# Altium schematic sheet Page 2.SchDoc
size 594 x 420 mm; Address1: Address1; Address2: Address2; Address3: Address3; Address4: Address4; DocumentNumber: НЭС.185014.2017-5.1; SheetNumber: 2; SheetTotal: 3; Scale: 1:1; DocumentType: Схема электрическая принципиальная; FirstReferrence: НЭС.185014.2017-5.1
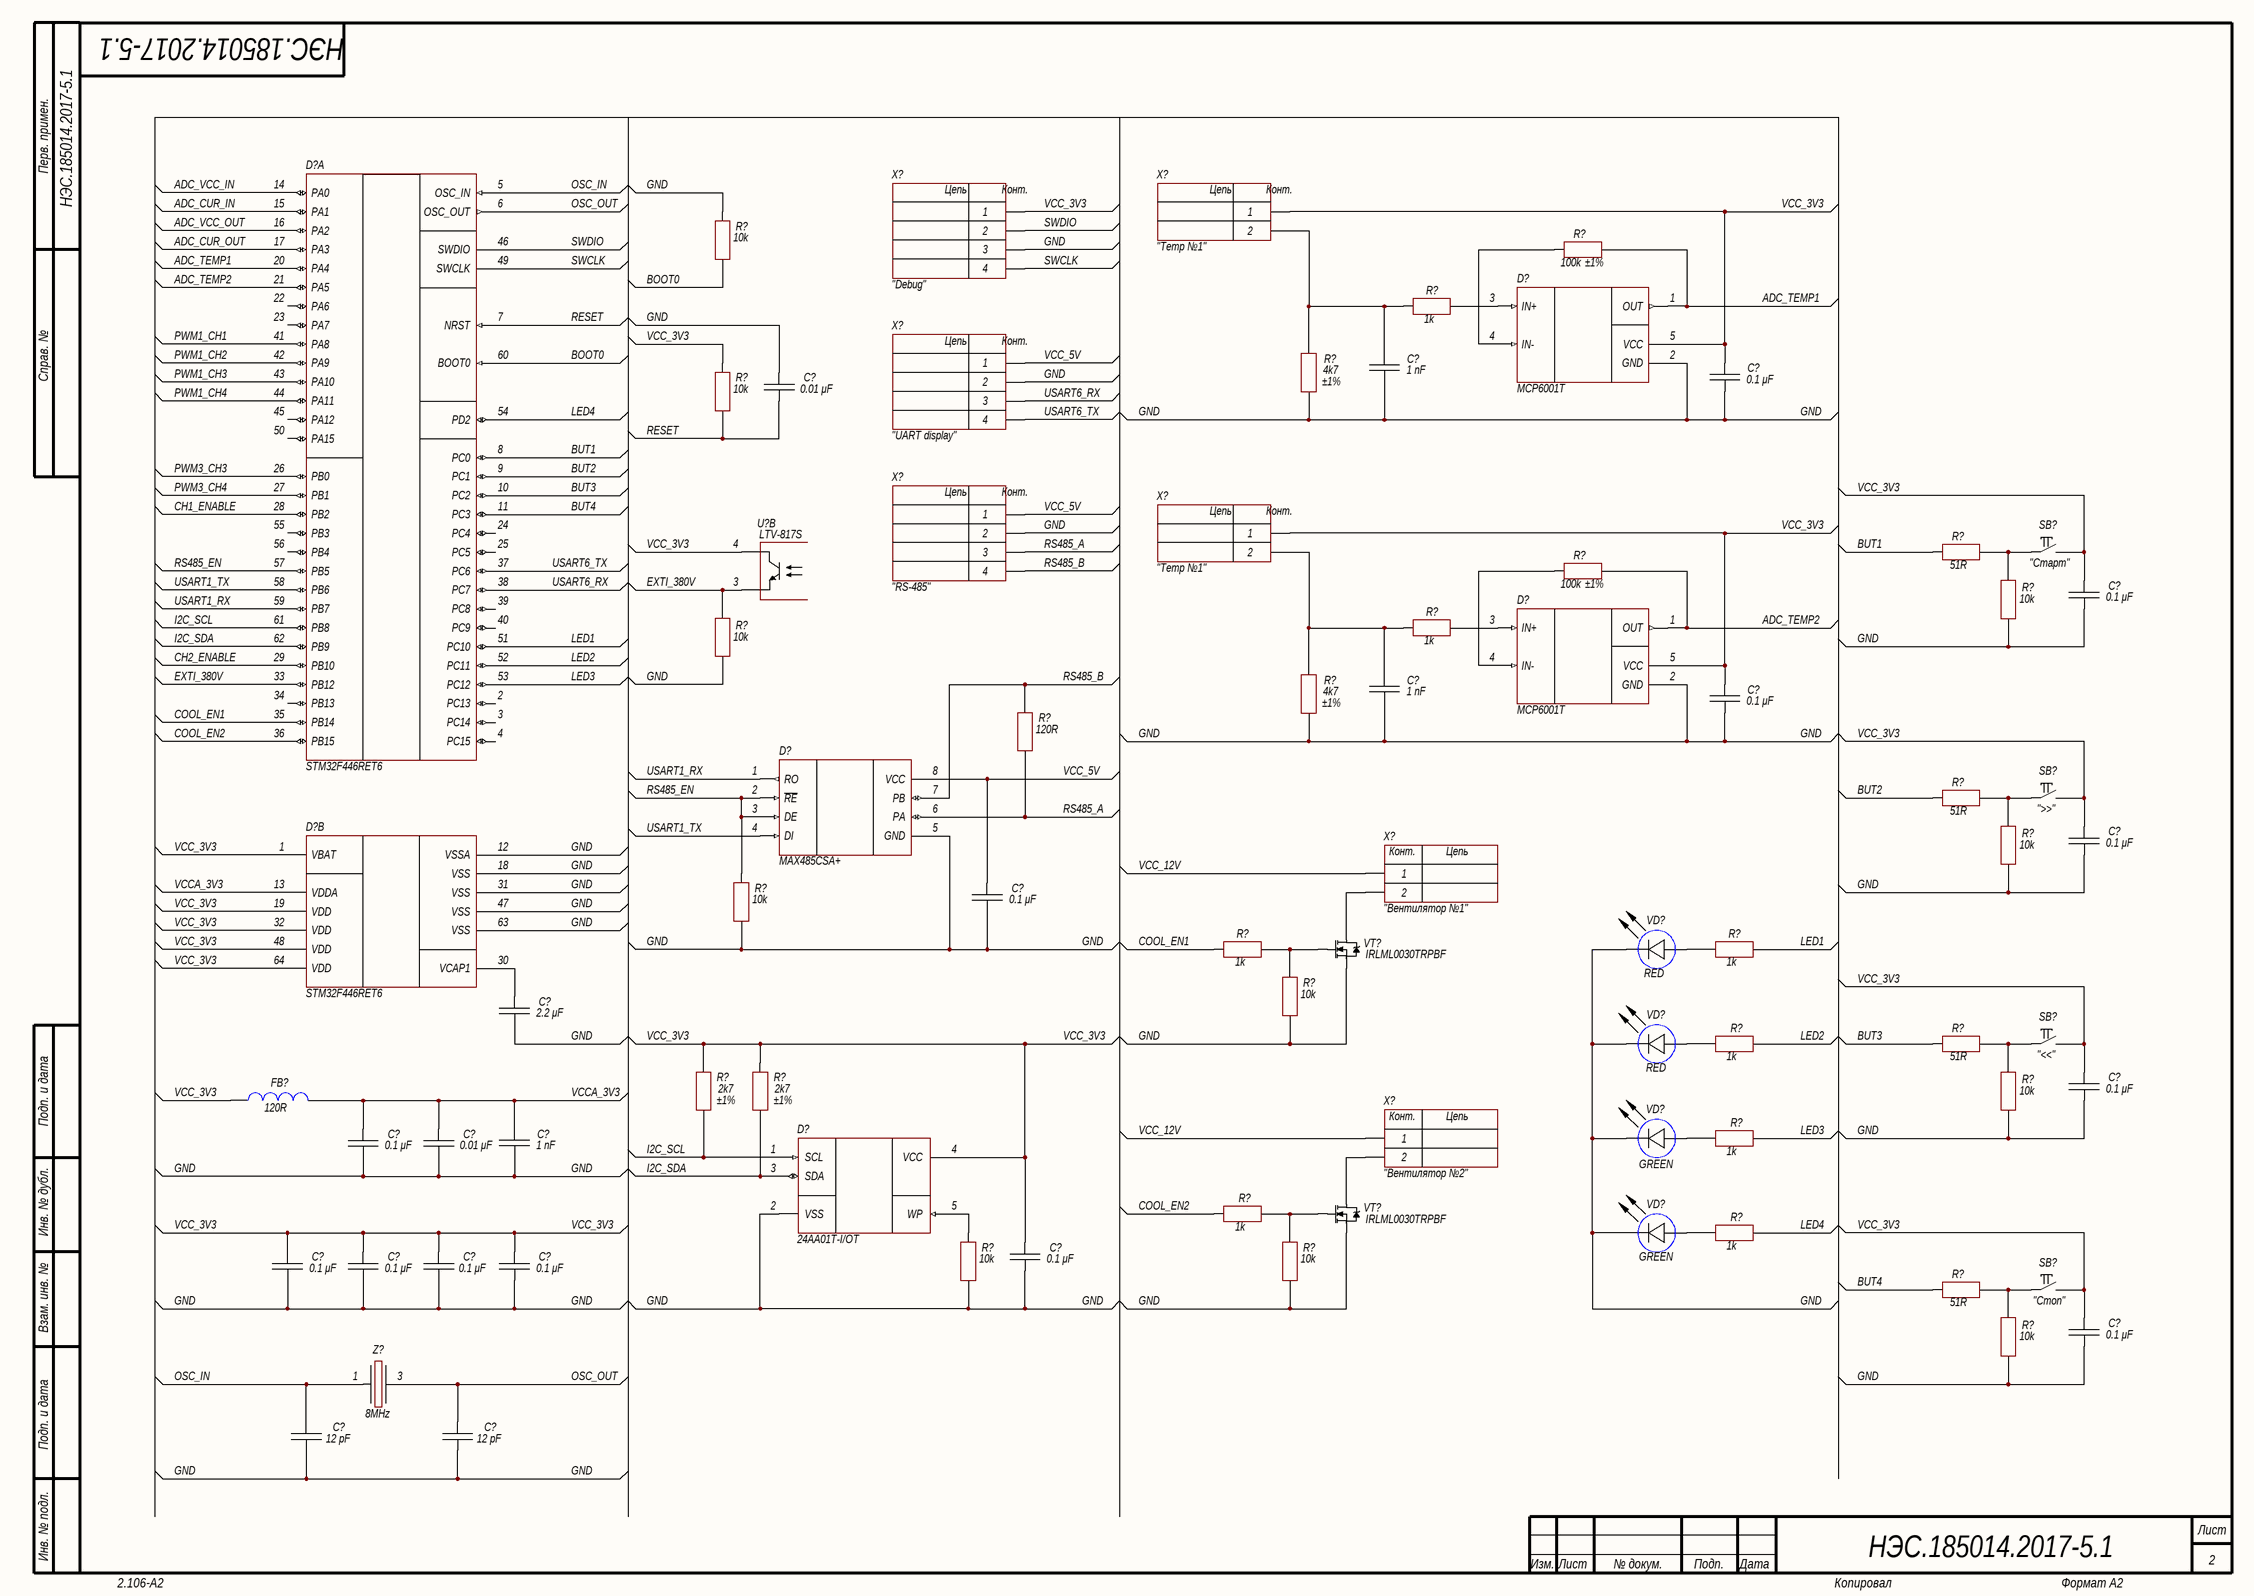
[diagram p0: Page 2.SchDoc]

## Parts
(Parts that share a designator on the sheet are numbered #1, #2 ... from top to bottom, then left to right.)
C?#1  1 nF  [CH0805C]
C?#2  0.1 μF  [CH0805C]
C?#3  0.01 μF  [CH0805C]
C?#4  0.1 μF  [CH0805C]
C?#5  1 nF  [CH0805C]
C?#6  0.1 μF  [CH0805C]
C?#7  0.1 μF  [CH0805C]
C?#8  0.1 μF  [CH0805C]
C?#9  2.2 μF  [CH0805C]
C?#10  0.1 μF  [CH0805C]
C?#11  0.1 μF  [CH0805C]
C?#12  0.01 μF  [CH0805C]
C?#13  1 nF  [CH0805C]
C?#14  0.1 μF  [CH0805C]
C?#15  0.1 μF  [CH0805C]
C?#16  0.1 μF  [CH0805C]
C?#17  0.1 μF  [CH0805C]
C?#18  0.1 μF  [CH0805C]
C?#19  0.1 μF  [CH0805C]
C?#20  12 pF  [CH0805C]
C?#21  12 pF  [CH0805C]
D?#1  STM32F446RET6  [64-LQFP]  (part A of 2)
D?#2  MCP6001T  [SOT23-5]
D?#3  MCP6001T  [SOT23-5]
D?#4  MAX485CSA+  [8-SOIC]
D?#5  STM32F446RET6  [64-LQFP]  (part B of 2)
D?#6  24AA01T-I/OT  [SOT23-5]
FB?  120R  [CH0805L]
R?#1  100k  ComponentKind: ±1%  [CH0805R]
R?#2  10k  [CH0805R]
R?#3  1k  [CH0805R]
R?#4  4k7  ComponentKind: ±1%  [CH0805R]
R?#5  10k  [CH0805R]
R?#6  51R  [CH0805R]
R?#7  100k  ComponentKind: ±1%  [CH0805R]
R?#8  1k  [CH0805R]
R?#9  10k  [CH0805R]
R?#10  10k  [CH0805R]
R?#11  4k7  ComponentKind: ±1%  [CH0805R]
R?#12  120R  [CH0805R]
R?#13  51R  [CH0805R]
R?#14  10k  [CH0805R]
R?#15  10k  [CH0805R]
R?#16  1k  [CH0805R]
R?#17  1k  [CH0805R]
R?#18  10k  [CH0805R]
R?#19  1k  [CH0805R]
R?#20  51R  [CH0805R]
R?#21  2k7  ComponentKind: ±1%  [CH0805R]
R?#22  2k7  ComponentKind: ±1%  [CH0805R]
R?#23  10k  [CH0805R]
R?#24  1k  [CH0805R]
R?#25  1k  [CH0805R]
R?#26  1k  [CH0805R]
R?#27  10k  [CH0805R]
R?#28  10k  [CH0805R]
R?#29  51R  [CH0805R]
R?#30  10k  [CH0805R]
SB?#1  "Старт"  [BUT: 6x6 SMD]
SB?#2  ">>"  [BUT: 6x6 SMD]
SB?#3  "<<"  [BUT: 6x6 SMD]
SB?#4  "Стоп"  [BUT: 6x6 SMD]
U?  LTV-817S  [4-SMD]  (part B of 2)
VD?#1  RED  [CH0805LR]
VD?#2  RED  [CH0805LR]
VD?#3  GREEN  [CH0805LG]
VD?#4  GREEN  [CH0805LG]
VT?#1  IRLML0030TRPBF  [SOT23_123]
VT?#2  IRLML0030TRPBF  [SOT23_123]
X?#1  "Debug"  [CON: PLD-4]
X?#2  "Temp №1"  [CON: WF-02]
X?#3  "UART display"  [CON: WF-04]
X?#4  "RS-485"  [CON: WF-04]
X?#5  "Temp №1"  [CON: WF-02]
X?#6  "Вентилятор №1"  [CON: WF-02]
X?#7  "Вентилятор №2"  [CON: WF-02]
Z?  8MHz  [OSC: 5032]

## Nets
ADC_CUR_IN: D?#1.15(PA1)
ADC_CUR_OUT: D?#1.17(PA3)
ADC_TEMP1: D?#1.20(PA4) D?#2.1(OUT) R?#1.2
ADC_TEMP2: D?#1.21(PA5) D?#3.1(OUT) R?#7.2
ADC_VCC_IN: D?#1.14(PA0)
ADC_VCC_OUT: D?#1.16(PA2)
BOOT0: D?#1.60(BOOT0) R?#2.1
BUT1: D?#1.8(PC0) R?#6.2
BUT2: D?#1.9(PC1) R?#13.2
BUT3: D?#1.10(PC2) R?#20.2
BUT4: D?#1.11(PC3) R?#29.2
CH1_ENABLE: D?#1.28(PB2)
CH2_ENABLE: D?#1.29(PB10)
COOL_EN1: D?#1.35(PB14) R?#16.2
COOL_EN2: D?#1.36(PB15) R?#25.2
EXTI_380V: D?#1.33(PB12) R?#10.2 U?.3(E)
GND: C?#1.1 C?#2.1 C?#3.2 C?#4.1 C?#5.1 C?#6.1 C?#7.1 C?#8.1 C?#9.1 C?#10.1 C?#11.1 C?#12.1 C?#13.1 C?#14.1 C?#15.1 C?#16.1 C?#17.1 C?#18.1 C?#19.1 C?#20.1 C?#21.1 D?#2.2(GND) D?#3.2(GND) D?#4.5(GND) D?#5.12(VSSA) D?#5.18(VSS) D?#5.31(VSS) D?#5.47(VSS) D?#5.63(VSS) D?#6.2(VSS) R?#2.2 R?#4.1 R?#9.1 R?#10.1 R?#11.1 R?#14.1 R?#15.1 R?#18.1 R?#23.1 R?#27.1 R?#28.1 R?#30.1 VD?#1.2(C) VD?#2.2(C) VD?#3.2(C) VD?#4.2(C) VT?#1.3(S) VT?#2.3(S) X?#1.3 X?#3.2 X?#4.2
I2C_SCL: D?#1.61(PB8) D?#6.1(SCL) R?#21.2
I2C_SDA: D?#1.62(PB9) D?#6.3(SDA) R?#22.2
LED1: D?#1.51(PC10) R?#17.1
LED2: D?#1.52(PC11) R?#19.1
LED3: D?#1.53(PC12) R?#24.1
LED4: D?#1.54(PD2) R?#26.1
OSC_IN: C?#20.2 D?#1.5(OSC_IN) Z?.1
OSC_OUT: C?#21.2 D?#1.6(OSC_OUT) Z?.3
PWM1_CH1: D?#1.41(PA8)
PWM1_CH2: D?#1.42(PA9)
PWM1_CH3: D?#1.43(PA10)
PWM1_CH4: D?#1.44(PA11)
PWM3_CH3: D?#1.26(PB0)
PWM3_CH4: D?#1.27(PB1)
RESET: C?#3.1 D?#1.7(NRST) R?#5.1
RS485_A: D?#4.6(PA) R?#12.1 X?#4.3
RS485_B: D?#4.7(PB) R?#12.2 X?#4.4
RS485_EN: D?#1.57(PB5) D?#4.2(~{RE}) D?#4.3(DE) R?#15.2
SWCLK: D?#1.49(SWCLK) X?#1.4
SWDIO: D?#1.46(SWDIO) X?#1.2
USART1_RX: D?#1.59(PB7) D?#4.1(RO)
USART1_TX: D?#1.58(PB6) D?#4.4(DI)
USART6_RX: D?#1.38(PC7) X?#3.3
USART6_TX: D?#1.37(PC6) X?#3.4
VCC_3V3: C?#2.2 C?#4.2 C?#6.2 C?#7.2 C?#10.2 C?#14.2 C?#15.2 C?#16.2 C?#17.2 C?#18.2 C?#19.2 D?#2.5(VCC) D?#3.5(VCC) D?#5.1(VBAT) D?#5.19(VDD) D?#5.32(VDD) D?#5.48(VDD) D?#5.64(VDD) D?#6.4(VCC) FB?.2 R?#5.2 R?#21.1 R?#22.1 SB?#1.2 SB?#2.2 SB?#3.2 SB?#4.2 U?.4(C) X?#1.1 X?#2.1 X?#5.1
VCC_5V: C?#8.2 D?#4.8(VCC) X?#3.1 X?#4.1
VCC_12V: X?#6.1 X?#7.1
VCCA_3V3: C?#11.2 C?#12.2 C?#13.2 D?#5.13(VDDA) FB?.1
NetC?#1_2: C?#1.2 R?#3.2 R?#4.2 X?#2.2
NetC?#5_2: C?#5.2 R?#8.2 R?#11.2 X?#5.2
NetC?#9_2: C?#9.2 D?#5.30(VCAP1)
NetD?#2_3: D?#2.3(IN+) R?#3.1
NetD?#2_4: D?#2.4(IN-) R?#1.1
NetD?#3_3: D?#3.3(IN+) R?#8.1
NetD?#3_4: D?#3.4(IN-) R?#7.1
NetD?#6_5: D?#6.5(WP) R?#27.2
NetR?#6_1: R?#6.1 R?#9.2 SB?#1.1
NetR?#13_1: R?#13.1 R?#14.2 SB?#2.1
NetR?#16_1: R?#16.1 R?#18.2 VT?#1.1(G)
NetR?#17_2: R?#17.2 VD?#1.1(A)
NetR?#19_2: R?#19.2 VD?#2.1(A)
NetR?#20_1: R?#20.1 R?#23.2 SB?#3.1
NetR?#24_2: R?#24.2 VD?#3.1(A)
NetR?#25_1: R?#25.1 R?#28.2 VT?#2.1(G)
NetR?#26_2: R?#26.2 VD?#4.1(A)
NetR?#29_1: R?#29.1 R?#30.2 SB?#4.1
NetVT?#1_2: VT?#1.2(D) X?#6.2
NetVT?#2_2: VT?#2.2(D) X?#7.2

Not connected (* = marked no-connect by the designer): D?#1 2(PC13) 3(PC14) 4(PC15) 22(PA6) 23(PA7) 24(PC4) 25(PC5) 34(PB13) 39(PC8) 40(PC9) 45(PA12) 50(PA15) 55(PB3) 56(PB4)

## Notes on the sheet
- Перв. примен.
- Справ. №
- Подп. и дата
- Инв. № дубл.
- Взам. инв. №
- Инв. № подл.
- Изм.
- Лист
- № докум.
- Подп.
- Дата
- 2.106-A2
- Копировал
- Формат А2
- (in symbol 2-Connector) Цепь; Конт.
- (in symbol 4-Connector) Цепь; Конт.

## Library data of the parts
C?#1 C?#5 C?#13 = Capacitor: Manufacturer: Yageo; Model: CC0805KRX7R9BB102; HelpURL: https://www.digikey.com/product-detail/en/yageo/CC0805KRX7R9BB102/311-1127-1-ND/303037; ComponentKind: X7R; Value: 1 nF
C?#2-C?#4 C?#6-C?#8 C?#10-C?#12 C?#14-C?#19 = Capacitor: Manufacturer: Yageo; Model: CC0805KRX7R8BB104; HelpURL: https://www.digikey.com/product-detail/en/yageo/CC0805KRX7R8BB104/311-1141-1-ND/303051; ComponentKind: X7R
  C?#2 C?#4 C?#6-C?#8 C?#10 C?#11 C?#14-C?#19: Value: 0.1 μF
  C?#3 C?#12: Value: 0.01 μF
C?#9 = Capacitor: Manufacturer: Yageo; Model: CC0805KKX7R6BB225; HelpURL: https://www.digikey.com/product-detail/en/yageo/CC0805KKX7R6BB225/311-1368-1-ND/2103152; ComponentKind: X7R; Value: 2.2 μF
C?#20 C?#21 = Capacitor: Manufacturer: Yageo; Model: CC0805JRNPO9BN120; HelpURL: https://www.digikey.com/product-detail/en/yageo/CC0805JRNPO9BN120/311-1100-1-ND/303010; ComponentKind: NP0; Value: 12 pF
D?#1 D?#5 = STM32F446RET6: Cortex-M4; Manufacturer: STMicroelectronics; Model: STM32F446RET6; HelpURL: https://www.digikey.com/product-detail/en/stmicroelectronics/STM32F446RET6/497-15376-ND/5175962; ComponentKind: 64-LQFP
D?#2 D?#3 = MCP6001T: OP amplifier; Manufacturer: Microchip Technology; Model: MCP6001T-I/OT; HelpURL: https://www.digikey.com/product-detail/en/microchip-technology/MCP6001T-I-OT/MCP6001T-I-OTCT-ND/697158; ComponentKind: SOT23-5
D?#4 = MAX485CSA+: RS485; Manufacturer: Maxim Integrated; Model: MAX485CSA+; HelpURL: https://www.digikey.com/product-detail/en/maxim-integrated/MAX485CSA/MAX485CSA-ND/948027; ComponentKind: 8-SOIC
D?#6 = 24AA01T-I/OT: EEPROM; Manufacturer: Microchip Technology; Model: 24AA01T-I/OT; HelpURL: https://www.digikey.com/product-detail/en/microchip-technology/24AA01T-I-OT/24AA01T-I-OTCT-ND/857670; ComponentKind: SOT23-5
FB? = Inductor: Manufacturer: Murata Electronics North America; Model: BLM21PG121SN1D; HelpURL: https://www.digikey.com/product-detail/en/murata-electronics-north-america/BLM21PG121SN1D/490-5986-1-ND/3845186; ComponentKind: 0805; Value: 120R
R?#1 R?#7 = Resistor: Manufacturer: Yageo; Model: RC0805FR-07100KL; HelpURL: https://www.digikey.com/product-detail/en/yageo/RC0805FR-07100KL/311-100KCRCT-ND/730491; Value: 100k
R?#2 R?#5 R?#9 R?#10 R?#14 R?#15 R?#18 R?#23 R?#27 R?#28 R?#30 = Resistor: Manufacturer: Yageo; Model: RC0805JR-0710KL; HelpURL: https://www.digikey.com/product-detail/en/yageo/RC0805JR-0710KL/311-10KARCT-ND/731188; ComponentKind: 0805; Value: 10k
R?#3 R?#8 R?#16 R?#17 R?#19 R?#24-R?#26 = Resistor: Manufacturer: Yageo; Model: RC0805JR-071KL; HelpURL: https://www.digikey.com/product-detail/en/yageo/RC0805JR-071KL/311-1.0KARCT-ND/731165; ComponentKind: 0805; Value: 1k
R?#4 R?#11 = Resistor: Manufacturer: Yageo; Model: RC0805FR-074K7L; HelpURL: https://www.digikey.com/product-detail/en/yageo/RC0805FR-074K7L/311-4.70KCRCT-ND/730876; Value: 4k7
R?#6 R?#13 R?#20 R?#29 = Resistor: Manufacturer: Yageo; Model: RC0805JR-0751RL; HelpURL: https://www.digikey.com/product-detail/en/yageo/RC0805JR-0751RL/311-51ARCT-ND/731292; ComponentKind: 0805; Value: 51R
R?#12 = Resistor: Manufacturer: Yageo; Model: RC0805JR-07120RL; HelpURL: https://www.digikey.com/product-detail/en/yageo/RC0805JR-07120RL/311-120ARCT-ND/731194; ComponentKind: 0805; Value: 120R
R?#21 R?#22 = Resistor: Manufacturer: Yageo; Model: RC0805FR-072K7L; HelpURL: https://www.digikey.com/product-detail/en/yageo/RC0805FR-072K7L/311-2.70KCRCT-ND/730653; Value: 2k7
SB?#1-SB?#4 = Tactile switches: 6x6 mm; Manufacturer: KLS; Model: L-KLS7-TS6604-4.3-180-B; HelpURL: https://www.chipdip.ru/product/kls7-ts6604-4.3-180-b-it-1102s; ComponentKind: 6x6mm
U? = Optoisolator: Manufacturer: Lite-On Inc.; Model: LTV-817S; HelpURL: https://www.digikey.com/product-detail/en/lite-on-inc/LTV-817S/160-1367-5-ND/385837; ComponentKind: 4-SMD
VD?#1 VD?#2 = LED: Manufacturer: Lite-On Inc.; Model: LTST-C171KRKT; HelpURL: https://www.digikey.com/product-detail/en/lite-on-inc/LTST-C171KRKT/160-1427-1-ND/386800; ComponentKind: 0805; Value: RED
VD?#3 VD?#4 = LED: Manufacturer: Lite-On Inc.; Model: LTST-C171GKT; HelpURL: https://www.digikey.com/product-detail/en/lite-on-inc/LTST-C171GKT/160-1423-1-ND/386792; ComponentKind: 0805; Value: GREEN
VT?#1 VT?#2 = N-chanel: Mosfet; Manufacturer: Infineon Technologies; Model: IRLML0030TRPBF; ComponentKind: SOT-23; HelpURL: https://www.digikey.com/product-detail/en/infineon-technologies/IRLML0030TRPBF/IRLML0030TRPBFCT-ND/2202231
X?#1 = 4-Connector: Model: PLD-4; Manufacturer: *; HelpURL: *; ComponentKind: *
X?#2 X?#5-X?#7 = 2-Connector: Model: WF-02; Manufacturer: *; HelpURL: *; ComponentKind: *
X?#3 X?#4 = 4-Connector: Model: WF-04; Manufacturer: *; HelpURL: *; ComponentKind: *
Z? = Oscillator: Manufacturer: Geyer; Model: KX-9A; HelpURL: http://www.electronshik.ru/item/kx-9a-80-mhz-209499; ComponentKind: 5032; Value: 8MHz